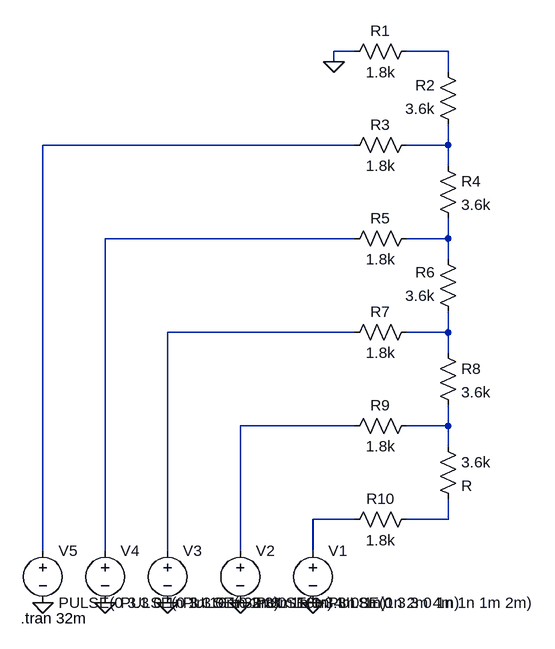
[diagram p0: schematic r2r för dac.asc]
r2r för dac.asc, the LTspice schematic file:
Version 4
SHEET 1 880 968
WIRE 176 80 144 80
WIRE 320 80 256 80
WIRE 144 96 144 80
WIRE 320 112 320 80
WIRE 176 224 -304 224
WIRE 320 224 320 192
WIRE 320 224 256 224
WIRE 320 256 320 224
WIRE 176 368 -208 368
WIRE 320 368 320 336
WIRE 320 368 256 368
WIRE 320 400 320 368
WIRE 176 512 -112 512
WIRE 320 512 320 480
WIRE 320 512 256 512
WIRE 320 544 320 512
WIRE 176 656 0 656
WIRE 320 656 320 624
WIRE 320 656 256 656
WIRE 320 688 320 656
WIRE 176 800 112 800
WIRE 320 800 320 768
WIRE 320 800 256 800
WIRE -304 848 -304 224
WIRE -208 848 -208 368
WIRE -112 848 -112 512
WIRE 0 848 0 656
WIRE 112 848 112 800
FLAG 144 96 0
FLAG 112 928 0
FLAG 0 928 0
FLAG -112 928 0
FLAG -208 928 0
FLAG -304 928 0
SYMBOL res 272 64 R90
WINDOW 0 0 56 VBottom 2
WINDOW 3 32 56 VTop 2
SYMATTR InstName R1
SYMATTR Value 1.8k
SYMBOL res 336 208 R180
WINDOW 0 36 76 Left 2
WINDOW 3 36 40 Left 2
SYMATTR InstName R2
SYMATTR Value 3.6k
SYMBOL res 160 240 R270
WINDOW 0 32 56 VTop 2
WINDOW 3 0 56 VBottom 2
SYMATTR InstName R3
SYMATTR Value 1.8k
SYMBOL res 304 240 R0
SYMATTR InstName R4
SYMATTR Value 3.6k
SYMBOL res 272 352 R90
WINDOW 0 0 56 VBottom 2
WINDOW 3 32 56 VTop 2
SYMATTR InstName R5
SYMATTR Value 1.8k
SYMBOL res 336 496 R180
WINDOW 0 36 76 Left 2
WINDOW 3 36 40 Left 2
SYMATTR InstName R6
SYMATTR Value 3.6k
SYMBOL res 160 528 R270
WINDOW 0 32 56 VTop 2
WINDOW 3 0 56 VBottom 2
SYMATTR InstName R7
SYMATTR Value 1.8k
SYMBOL res 304 528 R0
SYMATTR InstName R8
SYMATTR Value 3.6k
SYMBOL res 272 640 R90
WINDOW 0 0 56 VBottom 2
WINDOW 3 32 56 VTop 2
SYMATTR InstName R9
SYMATTR Value 1.8k
SYMBOL res 272 784 R90
WINDOW 0 0 56 VBottom 2
WINDOW 3 32 56 VTop 2
SYMATTR InstName R10
SYMATTR Value 1.8k
SYMBOL res 304 672 R0
SYMATTR InstName 3.6k
SYMBOL voltage 112 832 R0
WINDOW 123 0 0 Left 0
WINDOW 39 0 0 Left 0
SYMATTR InstName V1
SYMATTR Value PULSE(0 3.3 0 1n 1n 1m 2m)
SYMBOL voltage 0 832 R0
WINDOW 123 0 0 Left 0
WINDOW 39 0 0 Left 0
SYMATTR InstName V2
SYMATTR Value PULSE(0 3.3 0 1n 1n 2m 4m)
SYMBOL voltage -112 832 R0
WINDOW 123 0 0 Left 0
WINDOW 39 0 0 Left 0
SYMATTR InstName V3
SYMATTR Value PULSE(0 3.3 0 1n 1n 4m 8m)
SYMBOL voltage -208 832 R0
WINDOW 123 0 0 Left 0
WINDOW 39 0 0 Left 0
SYMATTR InstName V4
SYMATTR Value PULSE(0 3.3 0 1n 1n 8m 16m)
SYMBOL voltage -304 832 R0
WINDOW 123 0 0 Left 0
WINDOW 39 0 0 Left 0
SYMATTR InstName V5
SYMATTR Value PULSE(0 3.3 0 1n 1n 16m 32m)
TEXT -338 952 Left 2 !.tran 32m

The netlist it stands for:
* r2r för dac.asc
R1 N001 0 1.8k
R2 N003 N001 3.6k
R3 N002 N003 1.8k
R4 N003 N005 3.6k
R5 N005 N004 1.8k
R6 N007 N005 3.6k
R7 N006 N007 1.8k
R8 N007 N009 3.6k
R9 N009 N008 1.8k
R10 N011 N010 1.8k
R§3.6k N009 N011 R
V1 N010 0 PULSE(0 3.3 0 1n 1n 1m 2m)
V2 N008 0 PULSE(0 3.3 0 1n 1n 2m 4m)
V3 N006 0 PULSE(0 3.3 0 1n 1n 4m 8m)
V4 N004 0 PULSE(0 3.3 0 1n 1n 8m 16m)
V5 N002 0 PULSE(0 3.3 0 1n 1n 16m 32m)
.tran 32m
.backanno
.end